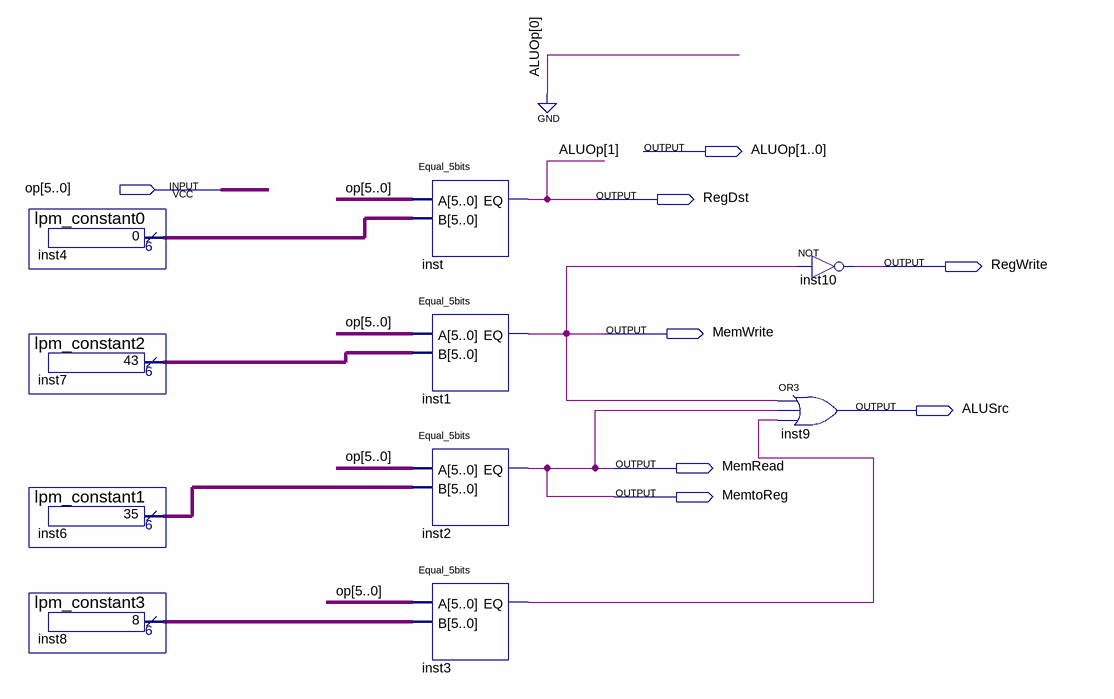
[diagram p0: schematic sheet]
// Quartus schematic Control.bdf as structural Verilog: 10 symbols, 8 pins
module Control (
  input  [5:0] op,
  output [1:0] ALUOp,
  output RegDst,
  output RegWrite,
  output MemWrite,
  output ALUSrc,
  output MemRead,
  output MemtoReg
);

  wire inst3_eq;
  wire [5:0] inst4_result, inst6_result, inst7_result, inst8_result;

  lpm_constant0 inst4 (.result(inst4_result));
  lpm_constant2 inst7 (.result(inst7_result));
  lpm_constant1 inst6 (.result(inst6_result));
  lpm_constant3 inst8 (.result(inst8_result));
  Equal_5bits inst (.A(op), .B(inst4_result), .EQ(ALUOp[1]));
  Equal_5bits inst1 (.A(op), .B(inst7_result), .EQ(MemWrite));
  Equal_5bits inst2 (.A(op), .B(inst6_result), .EQ(MemRead));
  Equal_5bits inst3 (.A(op), .B(inst8_result), .EQ(inst3_eq));
  not inst10 (RegWrite, MemWrite);
  or inst9 (ALUSrc, MemWrite, MemRead, inst3_eq);

  assign ALUOp[0] = 1'b0;
  assign MemtoReg = MemRead;
  assign RegDst = ALUOp[1];
endmodule
